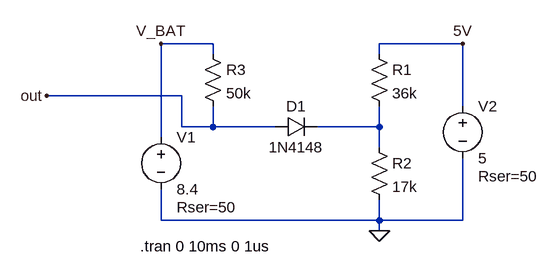
[diagram p0: schematic MotorDrive.asc]
MotorDrive.asc, the LTspice schematic file:
Version 4
SHEET 1 880 680
WIRE 0 32 -80 32
WIRE 384 32 256 32
WIRE 0 48 0 32
WIRE 256 48 256 32
WIRE -48 112 -256 112
WIRE 384 128 384 32
WIRE -48 160 -48 112
WIRE 0 160 0 128
WIRE 0 160 -48 160
WIRE 96 160 0 160
WIRE 256 160 256 128
WIRE 256 160 160 160
WIRE -80 176 -80 32
WIRE 256 192 256 160
WIRE -80 304 -80 256
WIRE 256 304 256 272
WIRE 256 304 -80 304
WIRE 384 304 384 208
WIRE 384 304 256 304
WIRE 256 320 256 304
FLAG 256 320 0
FLAG -256 112 out
FLAG -80 32 V_BAT
FLAG 384 32 5V
SYMBOL res 240 32 R0
SYMATTR InstName R1
SYMATTR Value 36k
SYMBOL res 240 176 R0
SYMATTR InstName R2
SYMATTR Value 17k
SYMBOL res -16 32 R0
SYMATTR InstName R3
SYMATTR Value 50k
SYMBOL diode 96 176 R270
WINDOW 0 32 32 VTop 2
WINDOW 3 0 32 VBottom 2
SYMATTR InstName D1
SYMATTR Value 1N4148
SYMBOL voltage -80 160 R0
WINDOW 123 0 0 Left 0
WINDOW 39 24 124 Left 2
SYMATTR SpiceLine Rser=50
SYMATTR InstName V1
SYMATTR Value 8.4
SYMBOL voltage 384 112 R0
WINDOW 123 0 0 Left 0
WINDOW 39 24 124 Left 2
SYMATTR SpiceLine Rser=50
SYMATTR InstName V2
SYMATTR Value 5
TEXT -112 344 Left 2 !.tran 0 10ms 0 1us

The netlist it stands for:
* MotorDrive.asc
R1 5V N001 36k
R2 N001 0 17k
R3 V_BAT out 50k
D1 out N001 1N4148
V1 V_BAT 0 8.4 Rser=50
V2 5V 0 5 Rser=50
.model D D
.lib standard.dio
.tran 0 10ms 0 1us
.backanno
.end